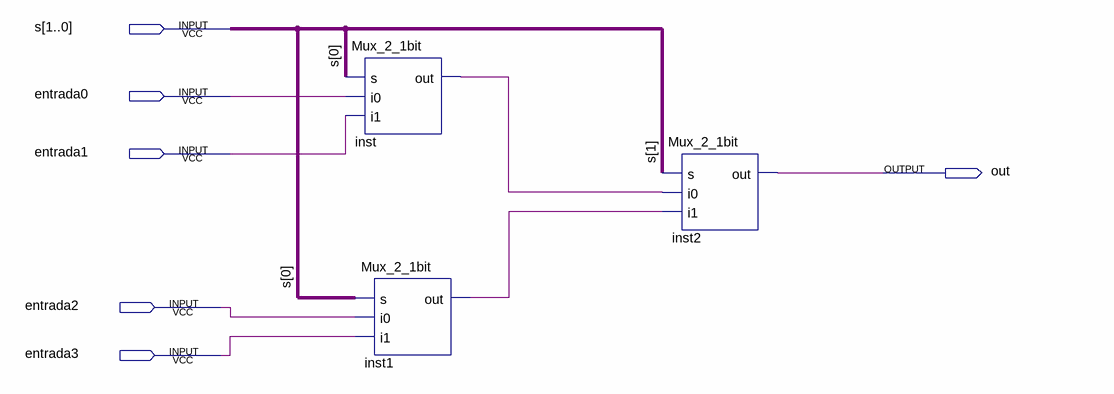
[diagram p0: schematic sheet]
// Quartus schematic Mux_4_1bit.bdf as structural Verilog: 3 symbols, 6 pins
module Mux_4_1bit (
  input  [1:0] s,
  input  entrada0,
  input  entrada1,
  input  entrada2,
  input  entrada3,
  output out
);

  wire inst1_out, inst_out;

  Mux_2_1bit inst (.s(s[0]), .i0(entrada0), .i1(entrada1), .out(inst_out));
  Mux_2_1bit inst1 (.s(s[0]), .i0(entrada2), .i1(entrada3), .out(inst1_out));
  Mux_2_1bit inst2 (.s(s[1]), .i0(inst_out), .i1(inst1_out), .out(out));
endmodule
